# EAGLE design tempSensorCR2032 (EAGLE 6.3)
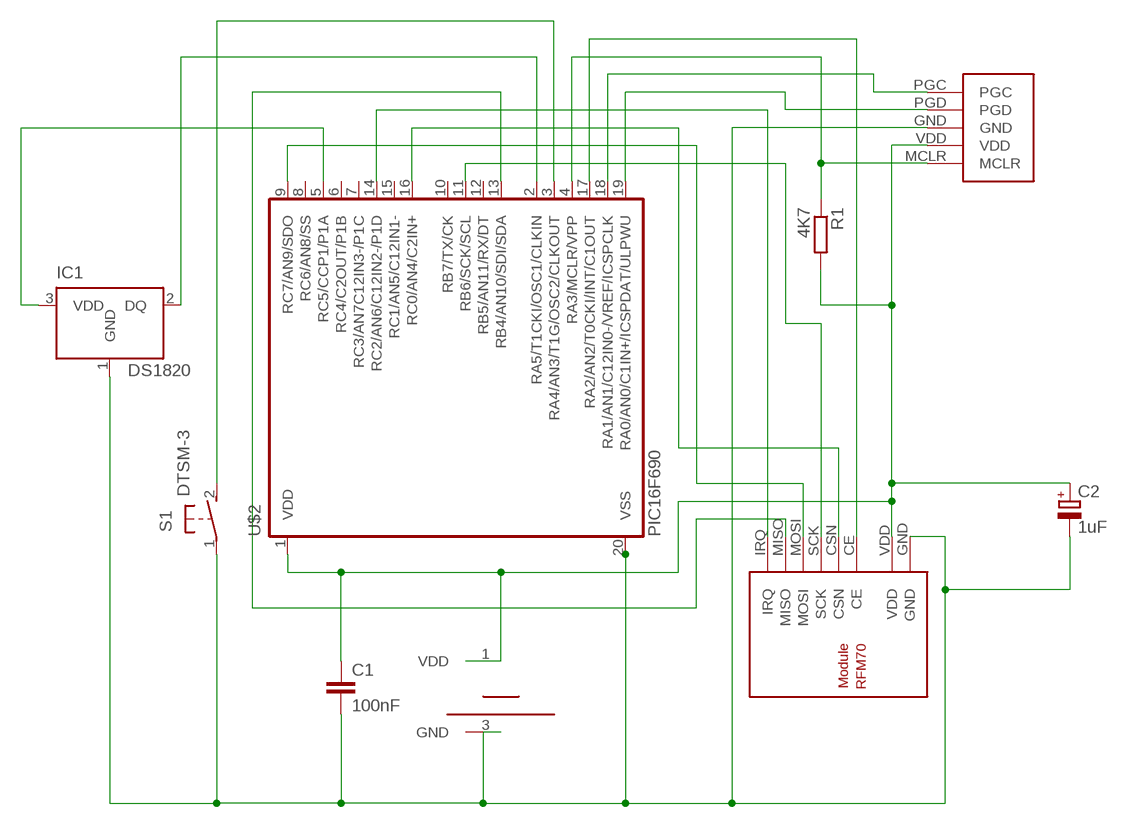
[diagram p0: schematic, sheet 1]

## Parts
C1  100nF  C-EUC2012  [C2012]
C2  1uF  CPOL-EUSMCA  [SMC_A]
IC1  DS1820  [TO-92]
R1  4K7  R-EU_R1206W  [R1206W]
S1  DTSM-3  [DTSM-3]
U$1  RFM70  [RFM70]
U$2  PIC16F690  [SSOP20]
U$3  PROGRAMMINGHEADERDIP  [PROGHEADER]
U$4  CR2032  [CR2032]

## Nets
N$1: IC1.2(DQ) U$2.2(RA5/T1CKI/OSC1/CLKIN)
N$2: S1.2 U$2.3(RA4/AN3/T1G/OSC2/CLKOUT)
N$3: IC1.3(VDD) U$2.5(RC5/CCP1/P1A)
N$4: C1.1 C2.+ R1.2 U$1.VDD U$2.1(VDD) U$3.VDD U$4.1(VDD)
N$8: U$2.19(RA0/AN0/C1IN+/ICSPDAT/ULPWU) U$3.PGD
N$11: U$2.18(RA1/AN1/C12IN0-/VREF/ICSPCLK) U$3.PGC
N$12: U$1.MISO U$2.13(RB4/AN10/SDI/SDA)
N$16: U$1.CE U$2.17(RA2/AN2/T0CKI/INT/C1OUT)
N$20: U$1.CSN U$2.16(RC0/AN4/C2IN+)
N$21: U$1.IRQ U$2.14(RC2/AN6/C12IN2-/P1D)
N$22: U$1.SCK U$2.11(RB6/SCK/SCL)
N$23: U$1.MOSI U$2.9(RC7/AN9/SDO)
N$25: R1.1 U$2.4(RA3/MCLR/VPP) U$3.MCLR
VD: C1.2 C2.- IC1.1(GND) S1.1 U$1.GND U$2.20(VSS) U$3.GND U$4.3(GND)
Unconnected: U$2.6(RC4/C2OUT/P1B) U$2.7(RC3/AN7C12IN3-/P1C) U$2.8(RC6/AN8/SS) U$2.10(RB7/TX/CK) U$2.12(RB5/AN11/RX/DT) U$2.15(RC1/AN5/C12IN1-)

## Library data of the parts
C1 = resistor:C-EU: CAPACITOR, European symbol
C2 = resistor:CPOL-EU: POLARIZED CAPACITOR, European symbol
IC1 = ds1820:DS1820: DS1820 - 1-Wire Digital Thermometer
R1 = resistor:R-EU_: RESISTOR, European symbol
S1 = switch-tact:DTSM-3
U$1 = rfm70:RFM70: RFM70 2.4 Ghz Funkmodul Autor: Daniel Weber Website: http://projects.web4clans.com Email: daniel.weber@web4clans.com
U$2 = microchip:PIC16F690*: MICROCONTROLLER PIC16F690 18 I/O One 16-bit timer Two 8-bit timer Two comparators Precision internal oscillator-software selectable 8 MHz - 32 KHz SSP w/ I2C Compatible Address mask option EUSART LIN 2.0 Compatible ECCP+ w/ PWM Steering 12 A/D Channels ULPW Enhanced Low Power Timer 1 Timer 1 Gate Synch Latch 4k Program Flash memory 256 bytes SRAM 256 bytes EEPROM
U$3 = rfm70:PROGRAMMINGHEADER
U$4 = rfm70:CR2032

## Board
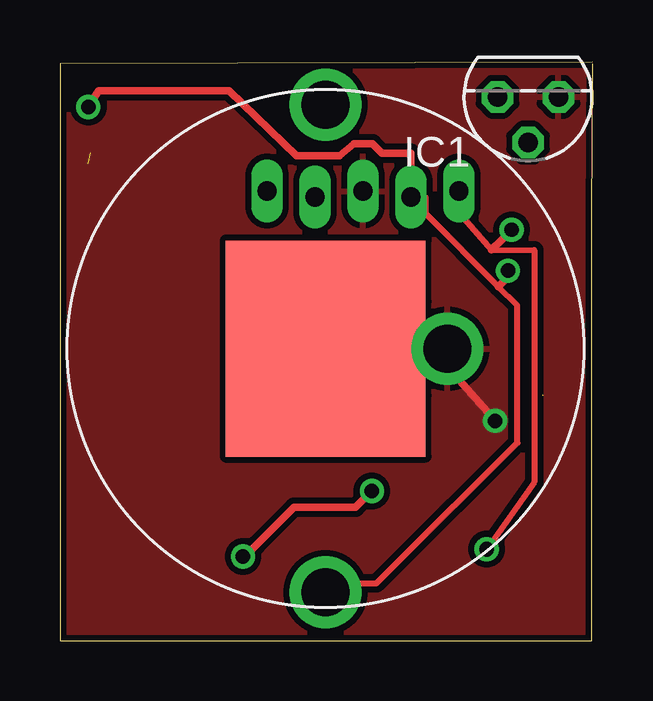
[diagram p1: board, top side]
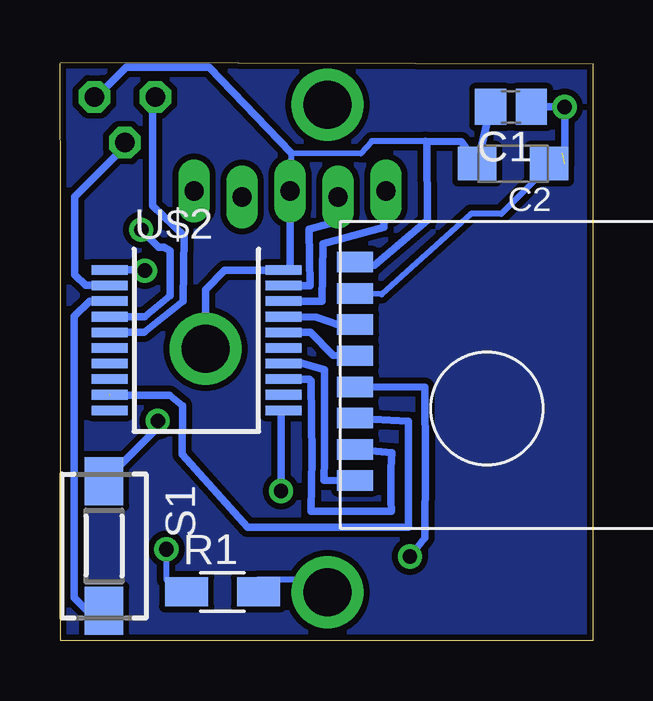
[diagram p2: board, bottom side, seen from below]

Size 22.22 x 24.12 mm. Coordinates in mm from the lower left corner, seen from the top.
Outline: 22.22,24.06 22.19,17.68 22.19,0 0.01,0.01 0,24.06 22.2,24.12
Copper layers (1*16): Top 0.035mm / dielectric 1.5mm / Bottom 0.035mm
Design rules "default *": minimum track width 10mil, minimum drill 24mil, track to track 8mil, track to pad 8mil, pad to pad 8mil, via to via 8mil, smd to smd 8mil, copper to edge 2mil, drill to drill 8mil, minimum pad ring 10mil, minimum via ring 8mil, stop-mask expansion 4mil, vias tented up to drill 0mil, thermal gap 10mil

### Footprints (pad centres in the part's own frame; a part is rotated, then mirrored left to right if it is on the bottom)
C2012 = smd 1.3 x 1.5: 1 -0.85,0; 2 0.85,0
SMC_A = smd 1.6 x 1.4: + -1.5,0; - 1.5,0
TO-92 = drill 0.813 pad 1.27 octagon: 1 -1.27,0; 2 0,1.905; 3 1.27,0
R1206W = smd 1.8 x 1.2: 1 -1.499,0; 2 1.499,0
DTSM-3 = smd 2 x 1.6: 1 -2.7,0; 2 2.7,0
RFM70 = smd 0.85 x 1.5: CE 2.5,-14.3; CSN 3.8,-14.3; GND -0.1,-14.3; IRQ 9,-14.3; MISO 7.7,-14.3; MOSI 6.4,-14.3; SCK 5.1,-14.3; VDD 1.2,-14.3
SSOP20 = smd 0.4 x 1.5: 1 -2.925,-3.625; 2 -2.275,-3.625; 3 -1.625,-3.625; 4 -0.975,-3.625; 5 -0.325,-3.625; 6 0.325,-3.625; 7 0.975,-3.625; 8 1.625,-3.625; 9 2.275,-3.625; 10 2.925,-3.625; 11 2.925,3.625; 12 2.275,3.625; 13 1.625,3.625; 14 0.975,3.625; 15 0.325,3.625; 16 -0.325,3.625; 17 -0.975,3.625; 18 -1.625,3.625; 19 -2.275,3.625; 20 -2.925,3.625
PROGHEADER = drill 0.8 long: GND 0,0; MCLR -4,0; PGC 4,0; PGD 2,0.25; VDD -2,0.25
CR2032 = drill 2: 1 0,3.81; 2 20.32,3.81; 3 10.16,-1.27 | smd 6.452 x 3.251: P$1 8.89,1.27; P$2 11.43,1.27; P$3 11.43,3.81; P$4 8.89,3.81; P$5 8.89,6.35; P$6 11.43,6.35

### Placement (x,y rotation side)
C1  3.42,22.25 180 bottom
C2  3.33,19.89 180 bottom
IC1  19.52,22.67 180 top
R1  15.44,2.04 0 bottom
S1  20.38,3.95 270 bottom
U$1  -4.38,15.68 270 bottom
U$2  16.54,12.53 270 bottom
U$3  12.64,18.75 180 top
U$4  14.88,2.02 90 top

### Tracks (layer width: path | path; a pad name or v marks a point on that pad's centre or on a via)
N$1
  Bottom 0.305: IC1.2 19.52,20.6 21.6,18.52 21.6,15.27 21.16,14.82 U$2.2
N$2
  Bottom 0.305: S1.2 21.09,1.25 21.63,1.79 21.63,13.53 20.99,14.16 U$2.3
N$3
  Bottom 0.305: U$2.5 18.71,12.86 17.09,14.15 17.06,16.89 18.35,18.12 18.35,22.63 IC1.3
N$4  (via drill 0.6)  (1 unrouted)
  Top 0.254: U$3.VDD 15.25,18.48 15.25,17.79 18.28,14.76 19.06,13.98 19.08,8.25 13.82,3.02 13.2,2.4 11.54,2.4 U$4.1
  Top 0.305: v18.68,15.43 18.85,15.33 18.28,14.76 | U$3.VDD 14.64,20.32 13.44,20.32 13.03,20.73 12.26,20.73 11.66,20.22 9.85,20.22 7.06,22.92 1.61,22.92 v1.18,22.25
  Bottom 0.254: 1.28,20.33 3.82,17.79 5.09,17.79 8.81,14.44 U$1.VDD | R1.2 13.98,2.55 11.44,2.55 U$4.1
  Bottom 0.305: U$2.1 18.86,15.46 v18.68,15.43 | C1.1 v1.18,22.25 1.18,19.89 C2.+
N$8
  Bottom 0.305: U$3.PGD 10.64,17.48 11.84,17.16 11.8,14.81 U$2.19
N$11
  Bottom 0.305: U$2.18 11.29,14.16 11.25,16.55 8.71,17.23 8.74,18.94 U$3.PGC
N$12
  Bottom 0.305: U$1.MISO 8.39,7.84 8.42,7.19 8.42,5.87 8.39,5.41 11.75,5.4 11.72,7.66 11.75,10.85 11.81,10.91 U$2.13
N$16
  Bottom 0.305: U$1.CE 10.57,13.15 11.52,13.49 U$2.17
N$20
  Bottom 0.305: U$1.CSN 10.83,11.91 11.79,12.86 U$2.16
N$21
  Bottom 0.305: U$1.IRQ 11.21,6.7 11.2,7.61 11.2,11.3 12.14,11.57 12.9,11.57 U$2.14
N$22  (via drill 0.6)
  Top 0.305: v7.63,3.52 7.71,3.52 8.2,4.01 8.19,4.01 9.75,5.58 12.33,5.58 v13,6.25
  Bottom 0.305: U$1.SCK 7.02,10.57 6.98,7.4 7.01,4.31 v7.63,3.52 | v13,6.25 13,9.52 U$2.11
N$23  (1 unrouted)
  Bottom 0.305: U$1.MOSI 7.7,9.14 7.7,8.24 7.7,5.63 7.68,4.74 14.4,4.74 17.13,7.77 17.11,9.79 17.65,10.24 20.14,10.24
N$25  (via drill 0.6, 0.61)
  Top 0.254: v17.79,3.82 19.77,6.62 19.77,16.28 17.99,16.29 16.67,17.79 U$3.MCLR
  Top 0.305: v18.83,17.13 18.83,17.12 17.99,16.29
  Bottom 0.254: v17.79,3.82 17.79,2.55 R1.1
  Bottom 0.305: U$2.4 18.7,13.51 17.64,14.39 17.64,16.26 17.88,16.41 18.11,16.41 v18.83,17.13
VD  (via drill 0.6)
  Top 0.305: U$4.3 16.15,11.43 v18.15,9.17
  Bottom 0.254: 6.98,20.83 9.22,20.83 9.68,20.32 12.6,20.33 U$3.GND
  Bottom 0.305: 4.39,21.65 C2.- 5.47,20.8 6.98,20.83 6.92,20.74 6.9,17.53 9.12,15.64 U$1.GND | U$3.GND 12.64,15.46 U$2.20 12.93,15.44 15.35,15.44 16.15,14.64 U$4.3 | IC1.1 20.64,22.73 19.47,23.9 16.01,23.9 12.6,20.33 | v18.15,9.17 18.15,8.88 S1.1
  Bottom 0.406: C1.2 4.39,22.25 4.39,21.65
  pour Top (isolate 0.254): 0.2,24.03 22.06,23.89 22.07,0.11 0.18,0.15
VDD
  pour Bottom (isolate 0.254): 0.19,23.93 22.11,24 22.09,0.15 0.15,0.15 0.05,13.31